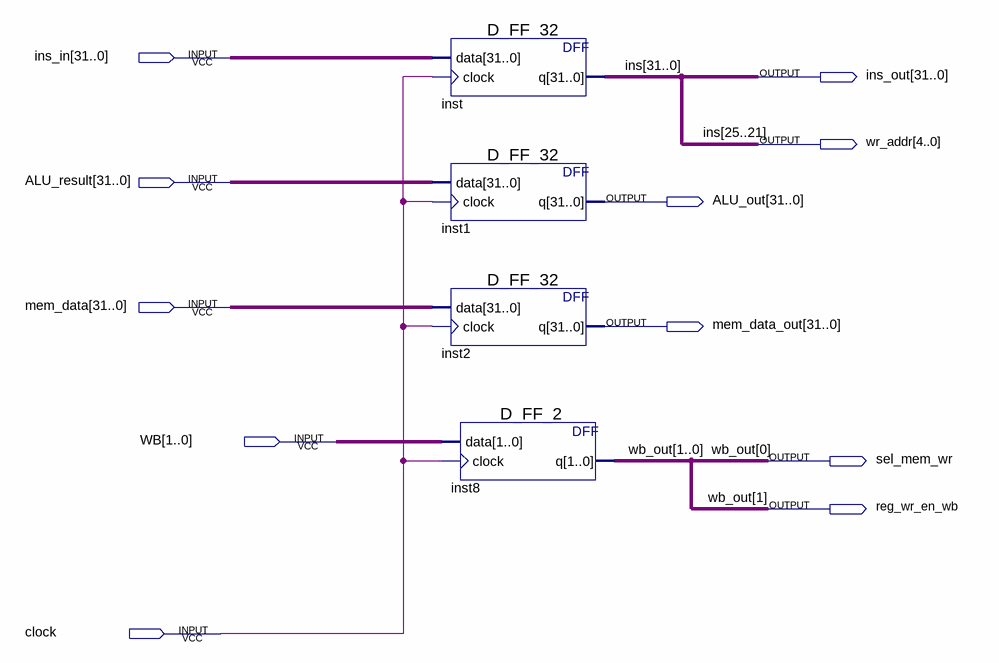
[diagram p0: schematic sheet]
// Quartus schematic MEM_WB.bdf as structural Verilog: 4 symbols, 11 pins
module MEM_WB (
  input  [31:0] ins_in,
  input  [31:0] ALU_result,
  input  [31:0] mem_data,
  input  [1:0] WB,
  input  clock,
  output [31:0] ins_out,
  output [4:0] wr_addr,
  output [31:0] ALU_out,
  output [31:0] mem_data_out,
  output sel_mem_wr,
  output reg_wr_en_wb
);

  D_FF_32 inst (.data(ins_in), .clock(clock), .q(ins_out));
  D_FF_32 inst1 (.data(ALU_result), .clock(clock), .q(ALU_out));
  D_FF_32 inst2 (.data(mem_data), .clock(clock), .q(mem_data_out));
  D_FF_2 inst8 (.data(WB), .clock(clock), .q({reg_wr_en_wb, sel_mem_wr}));

  assign wr_addr = ins_out[25:21];

  // Other names for the same wires on the sheet: ins[31:0] = ins_out; wb_out[1:0] = {reg_wr_en_wb, sel_mem_wr}
endmodule
